# EAGLE design seg7_minishield (EAGLE 6.3)
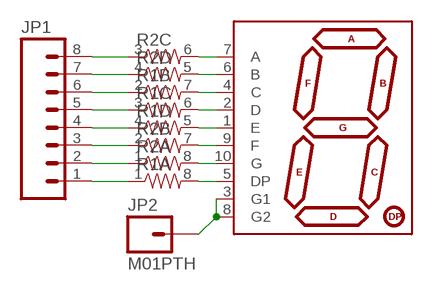
[diagram p0: schematic, sheet 1]

## Parts
JP1  M081X08  [1X08]
JP2  M01PTH  [1X01]
R1  RESISTOR-ARRAY0603-ARV  [0603-ARV]
R2  RESISTOR-ARRAY0603-ARV  [0603-ARV]
U$1  7-SEGMENT-DISPLAYPTH  [7-SEGMENT-DISPLAY]

## Nets
N$1: R1.5 U$1.1(E)
N$2: R1.6 U$1.2(D)
N$3: R1.7 U$1.4(C)
N$4: R1.8 U$1.5(DP)
N$5: R2.8 U$1.10(G)
N$6: R2.7 U$1.9(F)
N$7: R2.6 U$1.7(A)
N$8: R2.5 U$1.6(B)
N$9: JP2.1 U$1.3(G1) U$1.8(G2)
N$10: JP1.1 R1.1
N$11: JP1.6 R1.2
N$12: JP1.5 R1.3
N$13: JP1.4 R1.4
N$14: JP1.2 R2.1
N$15: JP1.3 R2.2
N$16: JP1.8 R2.3
N$17: JP1.7 R2.4

## Library data of the parts
JP1 = SparkFun-Connectors:M08: Header 8 Standard 8-pin 0.1" header. Use with straight break away headers (SKU : PRT-00116), right angle break away headers (PRT-00553), swiss pins (PRT-00743), machine pins (PRT-00117), and female headers (PRT-00115).
JP2 = SparkFun-Connectors:M01: Header 1 Standard 1-pin 0.1" header. Use with straight break away headers (SKU : PRT-00116), right angle break away headers (PRT-00553), swiss pins (PRT-00743), machine pins (PRT-00117), and female headers (PRT-00115).
R1 R2 = SparkFun-Passives:RESISTOR-ARRAY: Array Chip Resistor Source: RS Component / Phycomp
U$1 = SparkFun-Displays:7-SEGMENT-DISPLAY

## Board
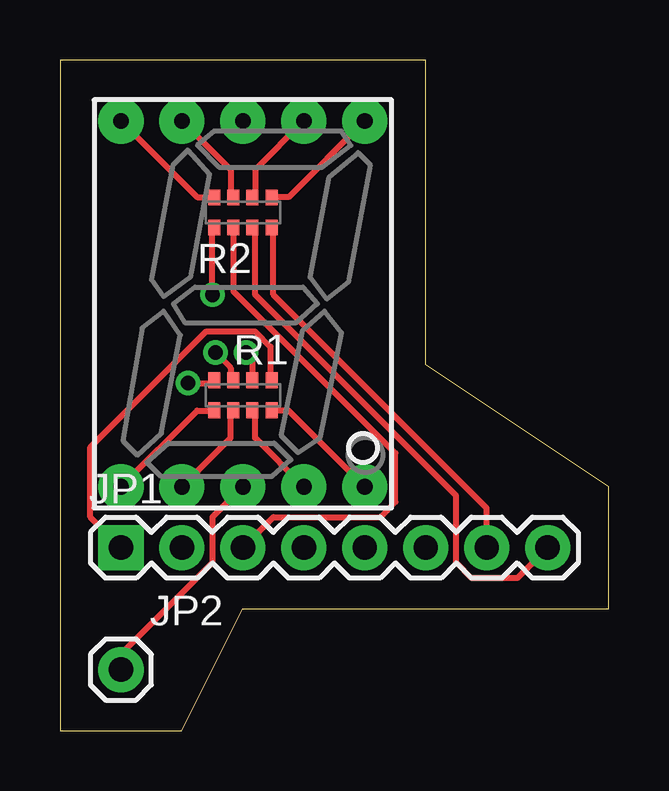
[diagram p1: board, top side]
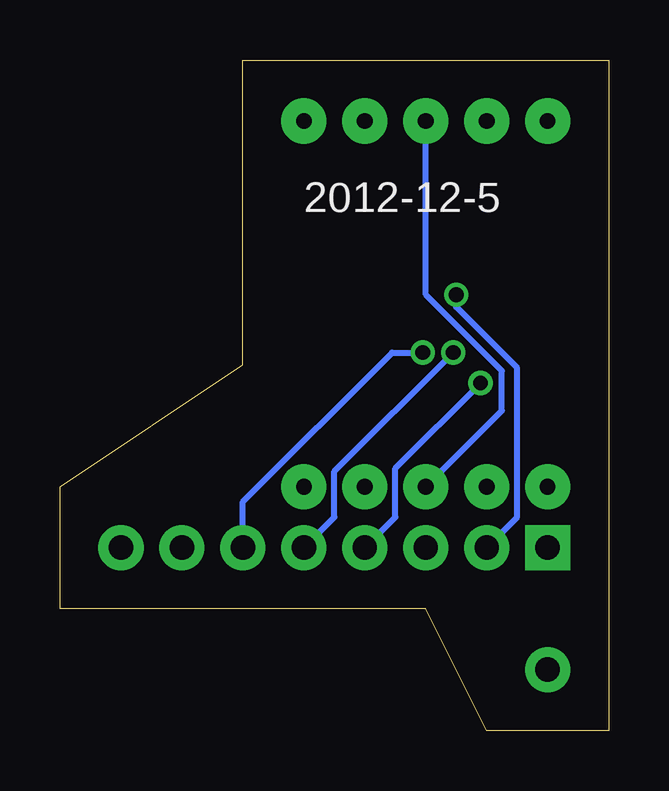
[diagram p2: board, bottom side, seen from below]

Size 22.86 x 27.94 mm. Coordinates in mm from the lower left corner, seen from the top.
Outline: 0,0 5.08,0 7.62,5.08 22.86,5.08 22.86,10.16 15.24,15.24 15.24,27.94 0,27.94 0,0
Copper layers (1*16): Top 0.035mm / dielectric 1.5mm / Bottom 0.035mm
Design rules "default": minimum track width 10mil, minimum drill 24mil, track to track 8mil, track to pad 8mil, pad to pad 8mil, via to via 8mil, smd to smd 8mil, copper to edge 40mil, drill to drill 8mil, minimum pad ring 10mil, minimum via ring 8mil, stop-mask expansion 4mil, vias tented up to drill 0mil, thermal gap 10mil

### Footprints (pad centres in the part's own frame; a part is rotated, then mirrored left to right if it is on the bottom)
1X08 = drill 1.016 pad 1.88 square: 1 0,0 | drill 1.016 pad 1.88: 2 2.54,0; 3 5.08,0; 4 7.62,0; 5 10.16,0; 6 12.7,0; 7 15.24,0; 8 17.78,0
1X01 = drill 1.016 pad 1.88: 1 0,0
0603-ARV = smd 0.5 x 0.65: 1 -1.2,-0.625; 2 -0.4,-0.625; 3 0.4,-0.625; 4 1.2,-0.625; 5 1.2,0.625; 6 0.4,0.625; 7 -0.4,0.625; 8 -1.2,0.625
7-SEGMENT-DISPLAY = drill 0.65 pad 1.88: 1 -5.08,-7.62; 2 -2.54,-7.62; 3 0,-7.62; 4 2.54,-7.62; 5 5.08,-7.62; 6 5.08,7.62; 7 2.54,7.62; 8 0,7.62; 9 -2.54,7.62; 10 -5.08,7.62

### Placement (x,y rotation side)
JP1  2.54,7.62 0 top
JP2  2.54,2.54 0 top
R1  7.62,13.97 180 top
R2  7.62,21.59 0 top
U$1  7.62,17.78 0 top

### Tracks (layer width: path | path; a pad name or v marks a point on that pad's centre or on a via)
N$1
  Top 0.254: U$1.1 5.71,13.34 6.35,13.34 R1.5
N$2
  Top 0.254: U$1.2 7.11,12.19 7.11,13.34 R1.6
N$3
  Top 0.254: U$1.4 8.13,12.19 8.13,13.34 R1.7
N$4
  Top 0.254: U$1.5 9.53,13.34 8.89,13.34 R1.8
N$5
  Top 0.254: U$1.10 5.71,22.23 6.35,22.23 R2.8
N$6
  Top 0.254: U$1.9 7.11,23.37 7.11,22.23 R2.7
N$7
  Top 0.254: U$1.7 8.13,23.37 8.13,22.23 R2.6
N$8
  Top 0.254: U$1.6 9.53,22.23 8.89,22.23 R2.5
N$9
  Top 0.254: JP2.1 2.54,3.17 6.35,6.99 6.35,8.89 U$1.3
  Bottom 0.254: U$1.8 7.62,18.16 4.45,14.99 4.45,13.34 U$1.3
N$10
  Top 0.254: JP1.1 1.27,8.89 1.27,11.81 6.1,16.64 8.13,16.64 8.76,16 8.76,14.61 R1.1
N$11  (via drill 0.61)
  Top 0.254: v7.75,15.75 8,15.49 8,14.61 R1.2
  Bottom 0.254: v7.75,15.75 9.02,15.75 15.24,9.53 JP1.6
N$12  (via drill 0.61)
  Top 0.254: v6.48,15.75 7.11,15.11 7.11,14.61 R1.3
  Bottom 0.254: v6.48,15.75 11.43,10.79 11.43,8.89 JP1.5
N$13  (via drill 0.61)
  Top 0.254: v5.33,14.48 6.35,14.48 R1.4
  Bottom 0.254: v5.33,14.48 8.89,10.92 8.89,8.89 JP1.4
N$14  (via drill 0.61)
  Top 0.254: v6.35,18.16 6.35,20.95 R2.1
  Bottom 0.254: v6.35,18.16 6.35,17.65 3.81,15.11 3.81,8.89 JP1.2
N$15
  Top 0.254: JP1.3 8.89,8.89 13.34,8.89 13.97,9.53 13.97,11.56 7.24,18.29 7.24,20.95 R2.2
N$16
  Top 0.254: R2.3 8.13,20.95 8.13,18.16 16.51,9.78 16.51,6.99 17.14,6.35 19.05,6.35 JP1.8
N$17
  Top 0.254: JP1.7 17.78,9.27 8.89,18.16 8.89,20.95 R2.4

### Text on the board
bPlace: 2012-12-5